# EAGLE design PGTNX04_envelope (EAGLE 9.6.0)
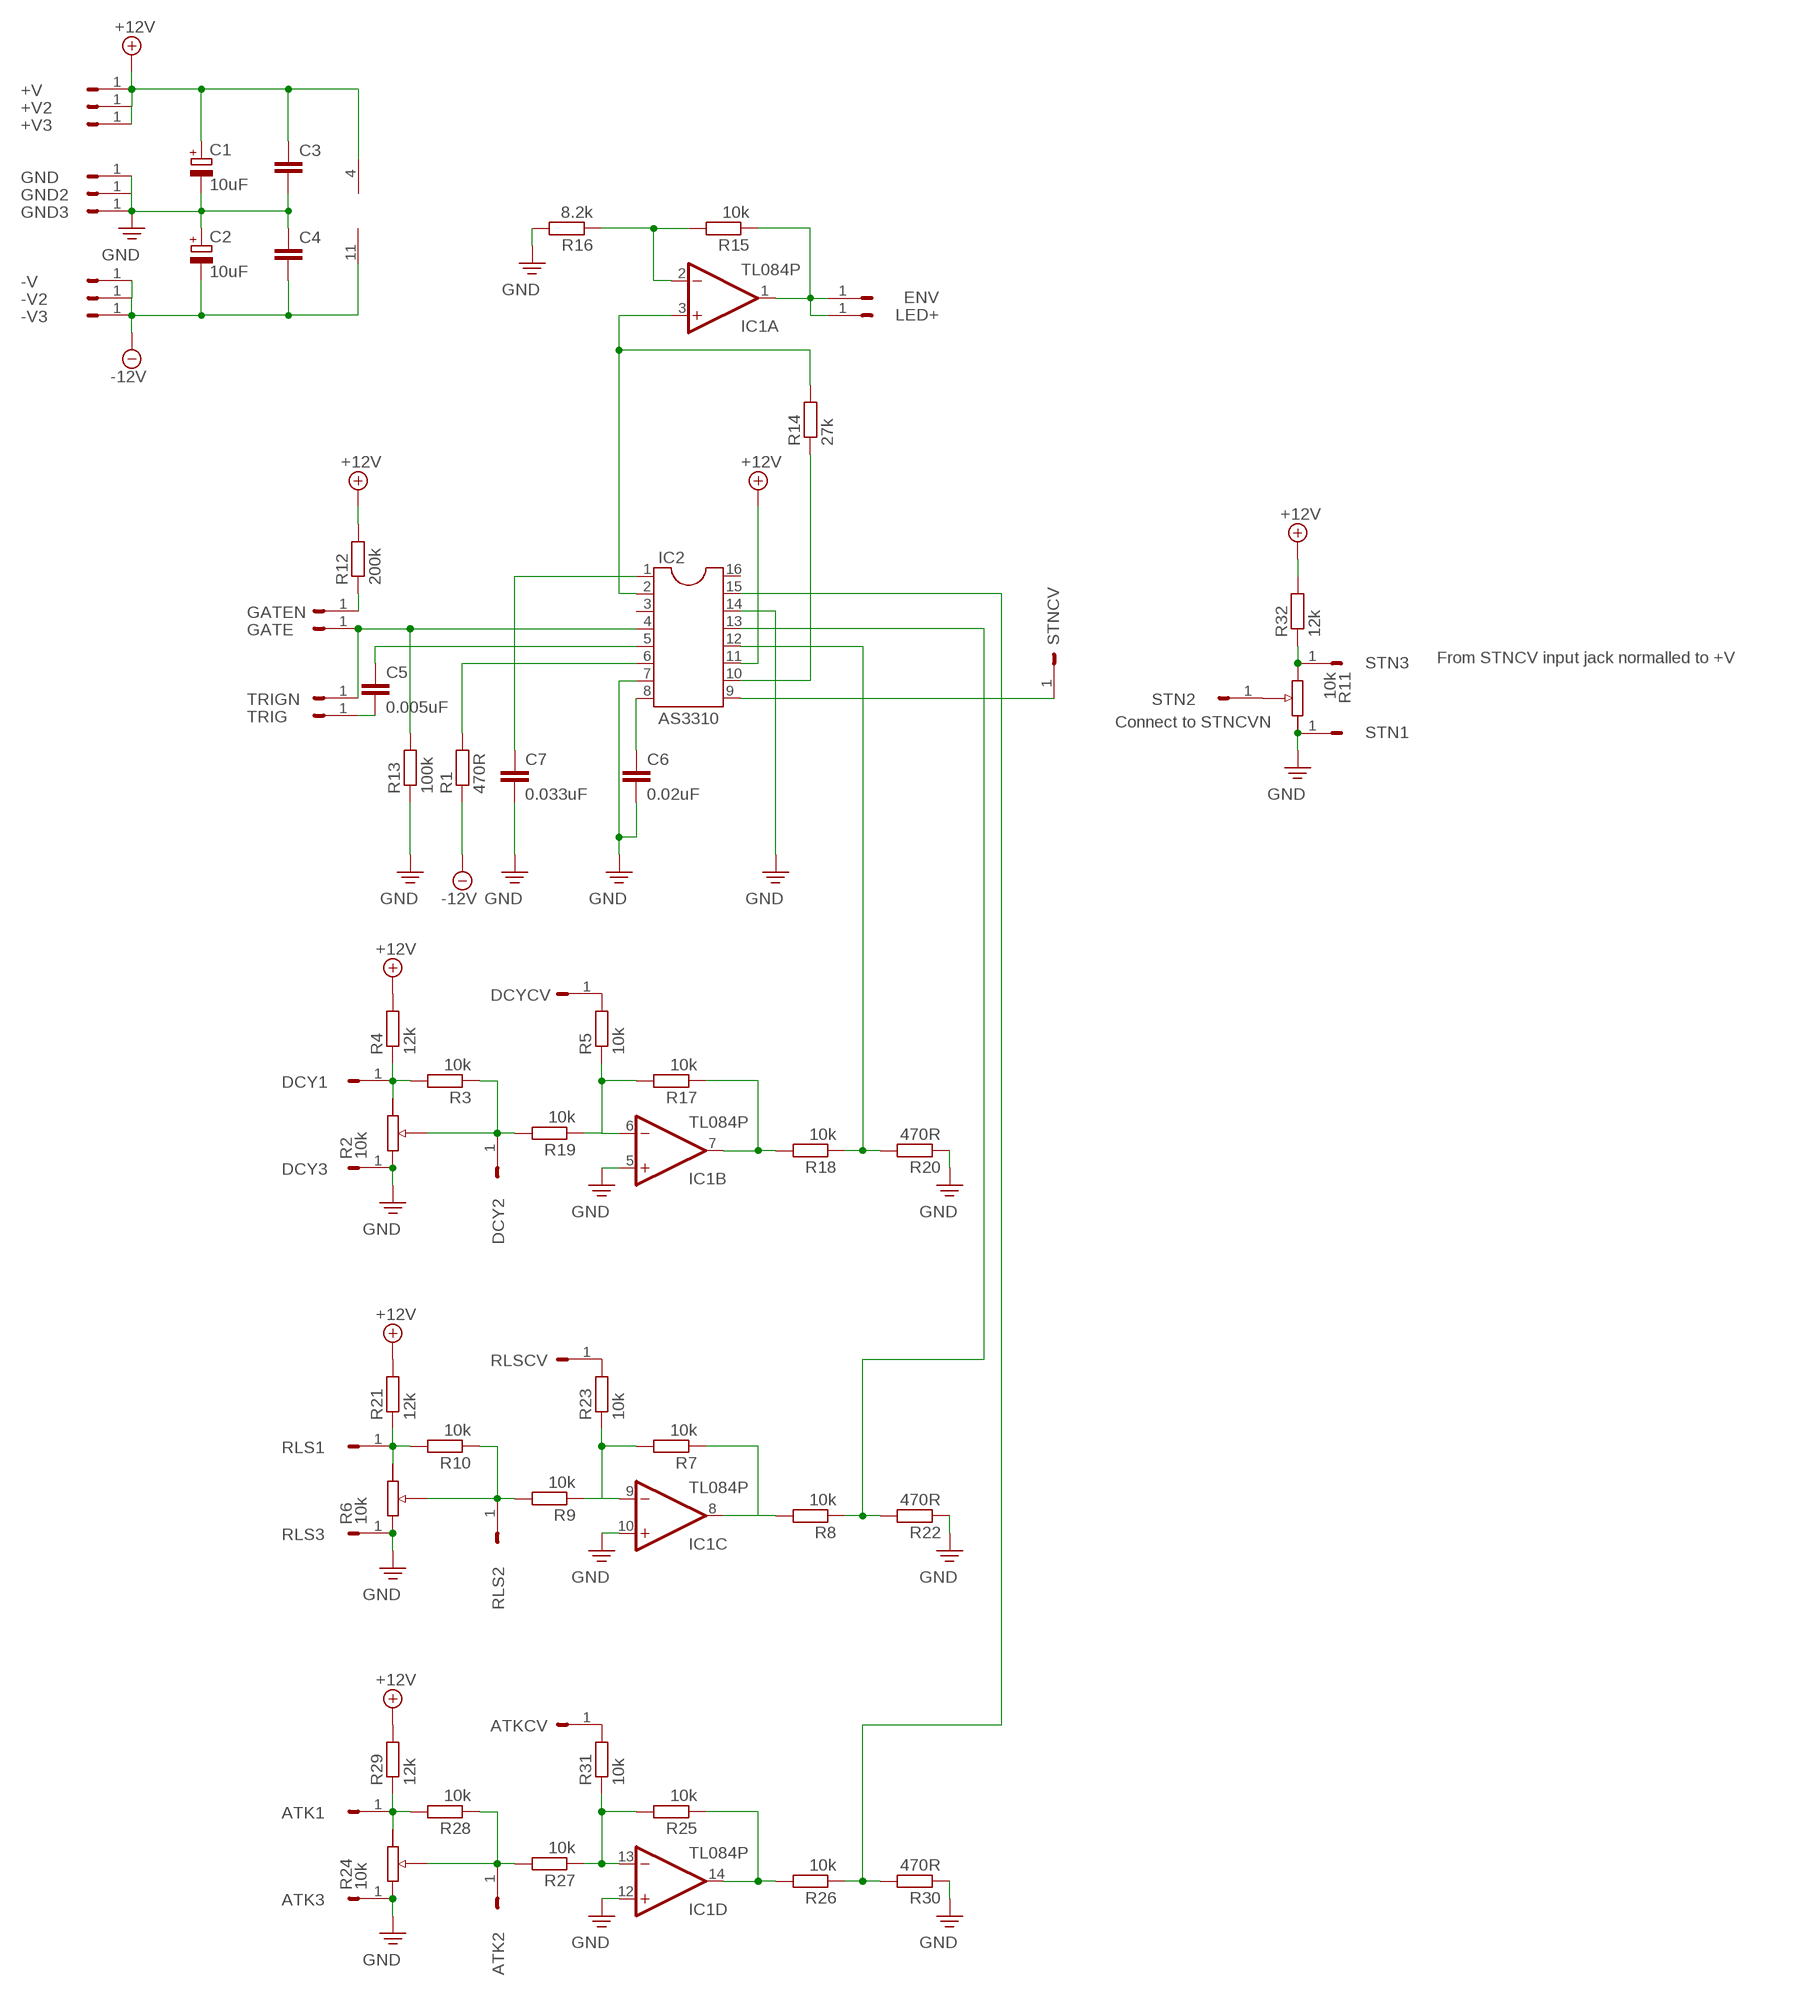
[diagram p0: schematic, sheet 1]

## Parts
+V  HEADER/MALE/01  [HEADER/MALE/01]
+V2  HEADER/MALE/01  [HEADER/MALE/01]
+V3  HEADER/MALE/01  [HEADER/MALE/01]
-V  HEADER/MALE/01  [HEADER/MALE/01]
-V2  HEADER/MALE/01  [HEADER/MALE/01]
-V3  HEADER/MALE/01  [HEADER/MALE/01]
ATK1  HEADER/MALE/01  [HEADER/MALE/01]
ATK2  HEADER/MALE/01  [HEADER/MALE/01]
ATK3  HEADER/MALE/01  [HEADER/MALE/01]
ATKCV  HEADER/MALE/01  [HEADER/MALE/01]
C1  10uF  CAPACITOR/POLARIZEDE2.5-6  [E2,5-6]
C2  10uF  CAPACITOR/POLARIZEDE2.5-6  [E2,5-6]
C3  CAPACITORCERAMICDISC/5  [CERAMICDISC/5]
C4  CAPACITORCERAMICDISC/5  [CERAMICDISC/5]
C5  0.005uF  CAPACITORCERAMICDISC/5  [CERAMICDISC/5]
C6  0.02uF  CAPACITORCERAMICDISC/5  [CERAMICDISC/5]
C7  0.033uF  CAPACITORCERAMICDISC/5  [CERAMICDISC/5]
DCY1  HEADER/MALE/01  [HEADER/MALE/01]
DCY2  HEADER/MALE/01  [HEADER/MALE/01]
DCY3  HEADER/MALE/01  [HEADER/MALE/01]
DCYCV  HEADER/MALE/01  [HEADER/MALE/01]
ENV  HEADER/MALE/01  [HEADER/MALE/01]
GATE  HEADER/MALE/01  [HEADER/MALE/01]
GATEN  HEADER/MALE/01  [HEADER/MALE/01]
GND  HEADER/MALE/01  [HEADER/MALE/01]
GND2  HEADER/MALE/01  [HEADER/MALE/01]
GND3  HEADER/MALE/01  [HEADER/MALE/01]
IC1  TL084P  [DIL14]
IC2  AS3310  DIL16  [DIL16]
LED+  HEADER/MALE/01  [HEADER/MALE/01]
R1  470R  RESISTORRESISTOR/UPRIGHT/7.5  [RESISTOR/7.5]
R2  10k  POTENTIOMETER  (no package)
R3  10k  RESISTORRESISTOR/UPRIGHT/7.5  [RESISTOR/7.5]
R4  12k  RESISTORRESISTOR/UPRIGHT/7.5  [RESISTOR/7.5]
R5  10k  RESISTORRESISTOR/UPRIGHT/7.5  [RESISTOR/7.5]
R6  10k  POTENTIOMETER  (no package)
R7  10k  RESISTORRESISTOR/UPRIGHT/7.5  [RESISTOR/7.5]
R8  10k  RESISTORRESISTOR/UPRIGHT/7.5  [RESISTOR/7.5]
R9  10k  RESISTORRESISTOR/UPRIGHT/7.5  [RESISTOR/7.5]
R10  10k  RESISTORRESISTOR/UPRIGHT/7.5  [RESISTOR/7.5]
R11  10k  POTENTIOMETER  (no package)
R12  200k  RESISTORRESISTOR/UPRIGHT/7.5  [RESISTOR/7.5]
R13  100k  RESISTORRESISTOR/UPRIGHT/7.5  [RESISTOR/7.5]
R14  27k  RESISTORRESISTOR/UPRIGHT/7.5  [RESISTOR/7.5]
R15  10k  RESISTORRESISTOR/UPRIGHT/7.5  [RESISTOR/7.5]
R16  8.2k  RESISTORRESISTOR/UPRIGHT/7.5  [RESISTOR/7.5]
R17  10k  RESISTORRESISTOR/UPRIGHT/7.5  [RESISTOR/7.5]
R18  10k  RESISTORRESISTOR/UPRIGHT/7.5  [RESISTOR/7.5]
R19  10k  RESISTORRESISTOR/UPRIGHT/7.5  [RESISTOR/7.5]
R20  470R  RESISTORRESISTOR/UPRIGHT/7.5  [RESISTOR/7.5]
R21  12k  RESISTORRESISTOR/UPRIGHT/7.5  [RESISTOR/7.5]
R22  470R  RESISTORRESISTOR/UPRIGHT/7.5  [RESISTOR/7.5]
R23  10k  RESISTORRESISTOR/UPRIGHT/7.5  [RESISTOR/7.5]
R24  10k  POTENTIOMETER  (no package)
R25  10k  RESISTORRESISTOR/UPRIGHT/7.5  [RESISTOR/7.5]
R26  10k  RESISTORRESISTOR/UPRIGHT/7.5  [RESISTOR/7.5]
R27  10k  RESISTORRESISTOR/UPRIGHT/7.5  [RESISTOR/7.5]
R28  10k  RESISTORRESISTOR/UPRIGHT/7.5  [RESISTOR/7.5]
R29  12k  RESISTORRESISTOR/UPRIGHT/7.5  [RESISTOR/7.5]
R30  470R  RESISTORRESISTOR/UPRIGHT/7.5  [RESISTOR/7.5]
R31  10k  RESISTORRESISTOR/UPRIGHT/7.5  [RESISTOR/7.5]
R32  12k  RESISTORRESISTOR/UPRIGHT/7.5  [RESISTOR/7.5]
RLS1  HEADER/MALE/01  [HEADER/MALE/01]
RLS2  HEADER/MALE/01  [HEADER/MALE/01]
RLS3  HEADER/MALE/01  [HEADER/MALE/01]
RLSCV  HEADER/MALE/01  [HEADER/MALE/01]
STN1  HEADER/MALE/01  [HEADER/MALE/01]
STN2  HEADER/MALE/01  [HEADER/MALE/01]
STN3  HEADER/MALE/01  [HEADER/MALE/01]
STNCV  HEADER/MALE/01  [HEADER/MALE/01]
TRIG  HEADER/MALE/01  [HEADER/MALE/01]
TRIGN  HEADER/MALE/01  [HEADER/MALE/01]

## Nets
+12V: +V2.1 +V3.1 +V.1 C1.+ C3.1 IC1.4(P:V+) IC2.11 R4.2 R12.2 R21.2 R29.2 R32.2
-12V: -V2.1 -V3.1 -V.1 C2.- C4.2 IC1.11(P:V-) R1.1
GND: ATK3.1 C1.- C2.+ C3.2 C4.1 C6.2 C7.2 DCY3.1 GND2.1 GND3.1 GND.1 IC1.5(B:+IN) IC1.10(C:+IN) IC1.12(D:+IN) IC2.7 IC2.14 R2.E R6.E R11.A R13.1 R16.2 R20.1 R22.1 R24.E R30.1 RLS3.1 STN1.1
N$1: IC2.9 STNCV.1
N$2: GATEN.1 R12.1
N$3: C5.1 IC2.5
N$4: GATE.1 IC2.4 R13.2 TRIGN.1
N$5: DCYCV.1 R5.2
N$6: IC1.8(C:OUT) R7.1 R8.2
N$7: IC1.9(C:-IN) R7.2 R9.1 R23.1
N$8: R6.S R9.2 R10.1 RLS2.1
N$9: C5.2 TRIG.1
N$10: R6.A R10.2 R21.1 RLS1.1
N$11: IC2.13 R8.1 R22.2
N$12: IC2.6 R1.2
N$13: C6.1 IC2.8
N$14: C7.1 IC2.1
N$15: IC1.2(A:-IN) R15.2 R16.1
N$16: IC2.10 R14.1
N$17: IC1.3(A:+IN) IC2.2 R14.2
N$18: ENV.1 IC1.1(A:OUT) LED+.1 R15.1
N$19: IC1.7(B:OUT) R17.1 R18.2
N$20: IC1.6(B:-IN) R5.1 R17.2 R19.1
N$21: DCY2.1 R2.S R3.1 R19.2
N$22: IC2.12 R18.1 R20.2
N$23: DCY1.1 R2.A R3.2 R4.1
N$24: R23.2 RLSCV.1
N$25: IC1.14(D:OUT) R25.1 R26.2
N$26: IC1.13(D:-IN) R25.2 R27.1 R31.1
N$27: ATK2.1 R24.S R27.2 R28.1
N$28: ATK1.1 R24.A R28.2 R29.1
N$29: IC2.15 R26.1 R30.2
N$30: ATKCV.1 R31.2
N$31: R11.E R32.1 STN3.1
N$32: R11.S STN2.1
Unconnected: IC2.3 IC2.16

## Notes on the sheet
- From STNCV input jack normalled to +V
- Connect to STNCVN

## Library data of the parts
+V +V2 +V3 -V -V2 -V3 ATK1-ATK3 ATKCV DCY1-DCY3 DCYCV ENV GATE GATEN GND GND2 GND3 LED+ RLS1-RLS3 RLSCV STN1-STN3 STNCV TRIG TRIGN = connectors:HEADER/MALE/01; SPICEPREFIX: X
C1 C2 = capacitors:CAPACITOR/POLARIZED: POLARIZED CAPACITOR, European symbol; SPICEPREFIX: C
C3-C7 = capacitors:CAPACITOR: CAPACITOR, European symbol
IC1 = ic_analogue:TL084: OP AMP
IC2 = ic_package:DIL16: Dual In Line / Socket
R1 R3-R5 R7-R10 R12-R23 R25-R32 = resistors:RESISTOR: RESISTOR, European symbol
R2 R6 R11 R24 = controls_off_brd:POTENTIOMETER: Trimm resistor; _EXTERNAL_: 1

## Board
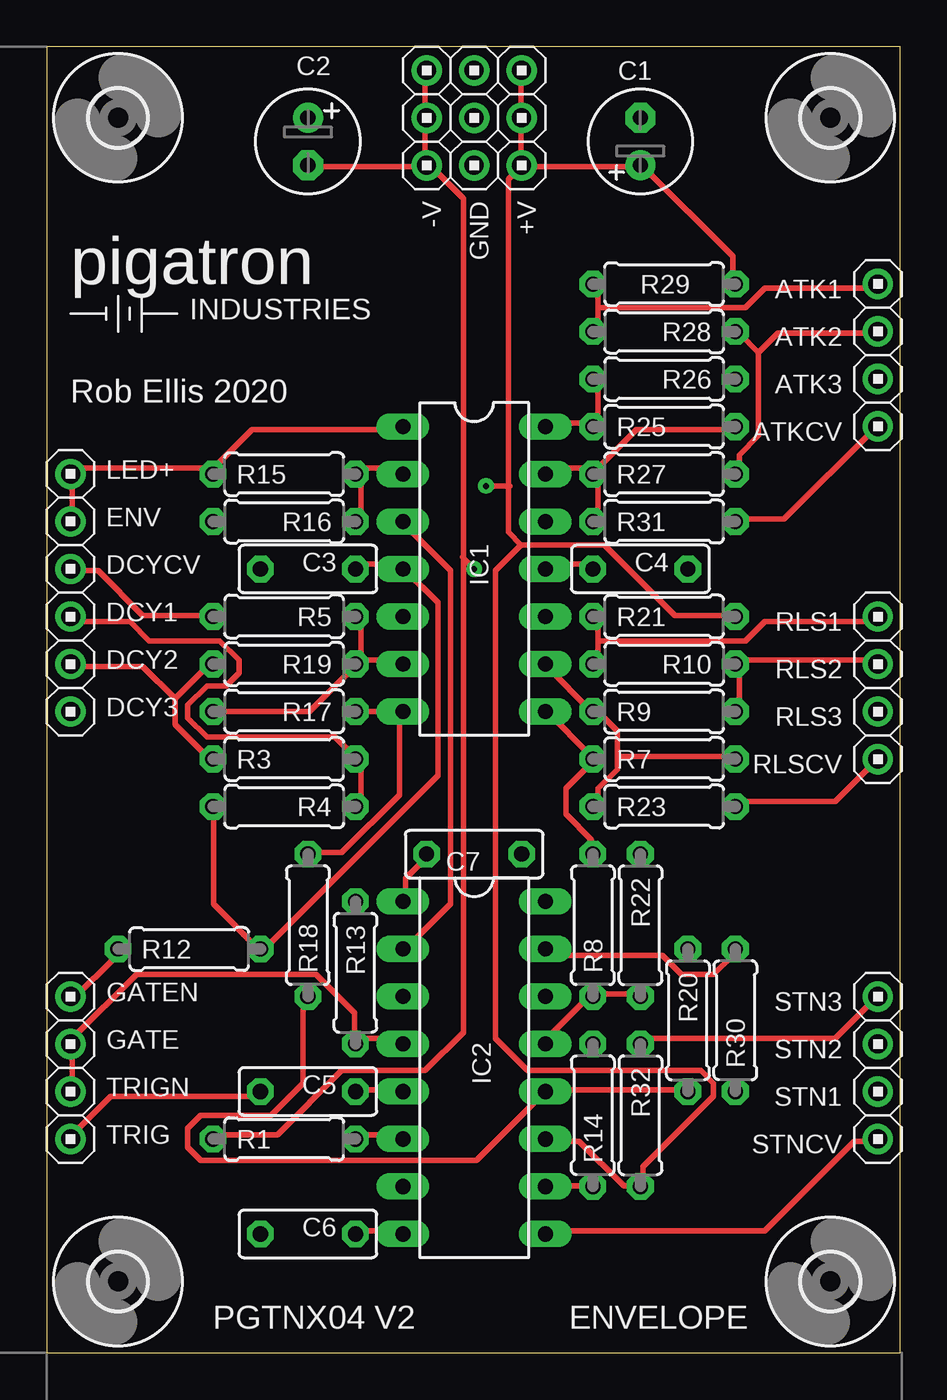
[diagram p1: board, top side]
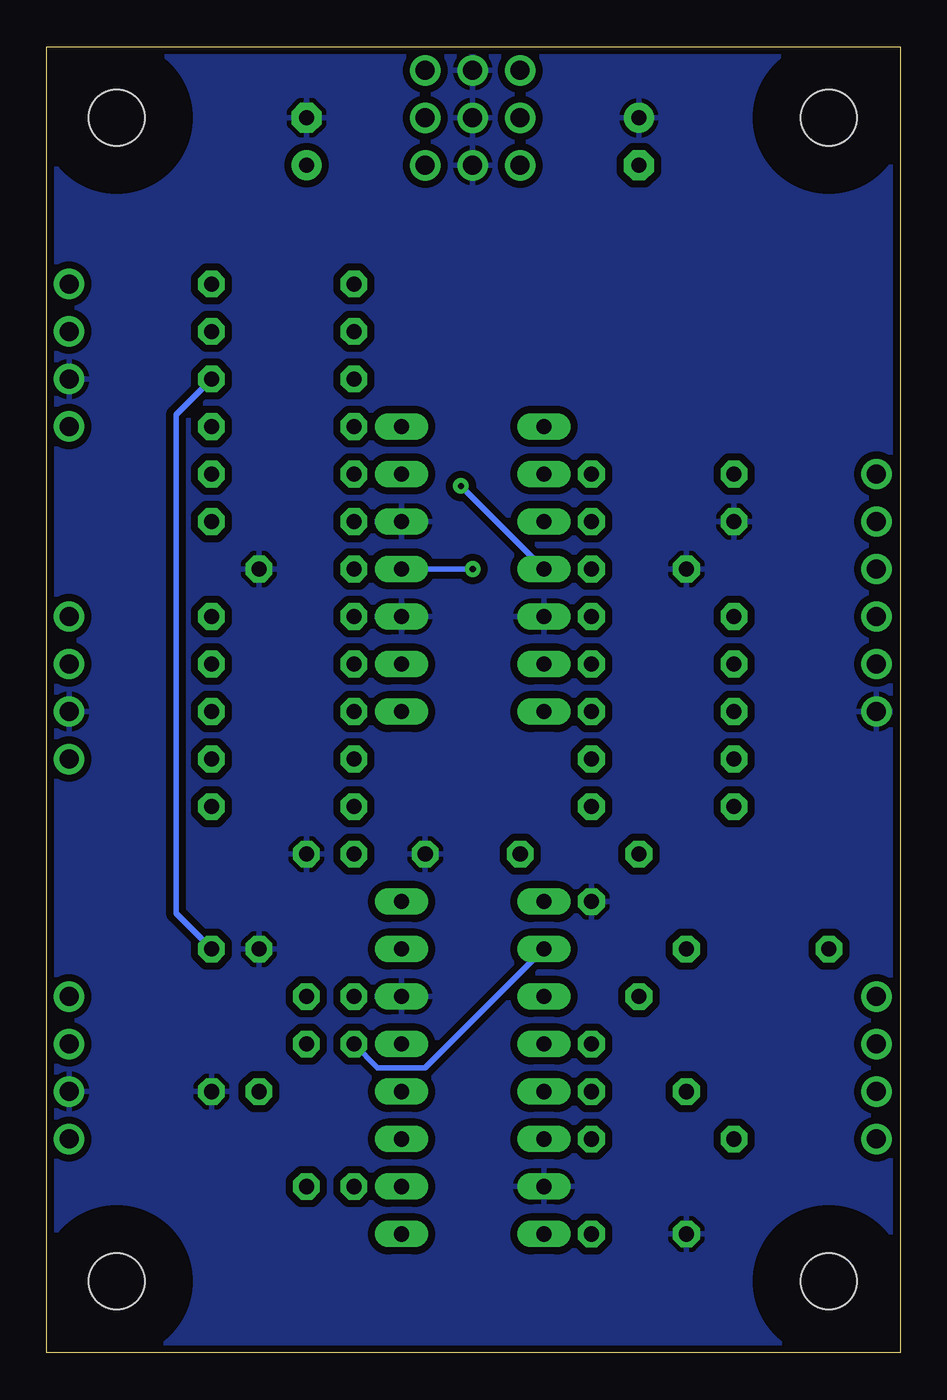
[diagram p2: board, bottom side, seen from below]

Size 45.64 x 69.84 mm. Coordinates in mm from the lower left corner, seen from the top.
Outline: 0,0 45.64,0 45.64,69.84 0,69.84 0,0
Copper layers (1*16): Top 0.0356mm / dielectric 1.5011mm / Bottom 0.0356mm
Design rules "pigatron": minimum track width 12mil, minimum drill 13mil, track to track 15mil, track to pad 10mil, pad to pad 10mil, via to via 10mil, smd to smd 6mil, copper to edge 15mil, drill to drill 10mil, minimum pad ring 12mil, minimum via ring 10mil, stop-mask expansion 4mil, vias tented up to drill 0mil, thermal gap 10mil

### Footprints (pad centres in the part's own frame; a part is rotated, then mirrored left to right if it is on the bottom)
HEADER/MALE/01 = drill 1.016: 1 0,0
E2,5-6 = drill 0.813 pad 1.6: + -1.27,0 | drill 0.813 pad 1.6 octagon: - 1.27,0
CERAMICDISC/5 = drill 0.813 octagon: 1 -2.54,0; 2 2.54,0
DIL14 = drill 0.813 long: 1 -7.62,-3.81; 2 -5.08,-3.81; 3 -2.54,-3.81; 4 0,-3.81; 5 2.54,-3.81; 6 5.08,-3.81; 7 7.62,-3.81; 8 7.62,3.81; 9 5.08,3.81; 10 2.54,3.81; 11 0,3.81; 12 -2.54,3.81; 13 -5.08,3.81; 14 -7.62,3.81
DIL16 = drill 0.813 long: 1 -8.89,-3.81; 2 -6.35,-3.81; 3 -3.81,-3.81; 4 -1.27,-3.81; 5 1.27,-3.81; 6 3.81,-3.81; 7 6.35,-3.81; 8 8.89,-3.81; 9 8.89,3.81; 10 6.35,3.81; 11 3.81,3.81; 12 1.27,3.81; 13 -1.27,3.81; 14 -3.81,3.81; 15 -6.35,3.81; 16 -8.89,3.81
RESISTOR/7.5 = drill 0.813 octagon: 1 -3.81,0; 2 3.81,0
STANDOFF/3.0 = hole 3: 0,0

### Placement (x,y rotation side)
+V  25.4,63.5 270 top
+V2  25.4,66.04 270 top
+V3  25.4,68.58 270 top
-V  20.32,63.5 270 top
-V2  20.32,66.04 270 top
-V3  20.32,68.58 270 top
ATK1  44.45,57.15 180 top
ATK2  44.45,54.61 180 top
ATK3  44.45,52.07 180 top
ATKCV  44.45,49.53 180 top
C1  31.75,64.77 90 top
C2  13.97,64.77 270 top
C3  13.97,41.91 180 top
C4  31.75,41.91 180 top
C5  13.97,13.97 180 top
C6  13.97,6.35 180 top
C7  22.86,26.67 0 top
DCY1  1.27,39.37 0 top
DCY2  1.27,36.83 0 top
DCY3  1.27,34.29 0 top
DCYCV  1.27,41.91 0 top
ENV  1.27,44.45 0 top
GATE  1.27,16.51 0 top
GATEN  1.27,19.05 0 top
GND  22.86,63.5 270 top
GND2  22.86,68.58 270 top
GND3  22.86,66.04 270 top
IC1  22.86,41.91 270 top
IC2  22.86,15.24 270 top
LED+  1.27,46.99 0 top
R1  12.7,11.43 0 top
R3  12.7,31.75 0 top
R4  12.7,29.21 180 top
R5  12.7,39.37 180 top
R7  33.02,31.75 0 top
R8  29.21,22.86 90 top
R9  33.02,34.29 0 top
R10  33.02,36.83 180 top
R12  7.62,21.59 0 top
R13  16.51,20.32 270 top
R14  29.21,12.7 90 top
R15  12.7,46.99 0 top
R16  12.7,44.45 180 top
R17  12.7,34.29 180 top
R18  13.97,22.86 90 top
R19  12.7,36.83 180 top
R20  34.29,17.78 270 top
R21  33.02,39.37 0 top
R22  31.75,22.86 270 top
R23  33.02,29.21 0 top
R25  33.02,49.53 0 top
R26  33.02,52.07 180 top
R27  33.02,46.99 0 top
R28  33.02,54.61 180 top
R29  33.02,57.15 0 top
R30  36.83,17.78 90 top
R31  33.02,44.45 0 top
R32  31.75,12.7 270 top
RLS1  44.45,39.37 180 top
RLS2  44.45,36.83 180 top
RLS3  44.45,34.29 180 top
RLSCV  44.45,31.75 180 top
STN1  44.45,13.97 180 top
STN2  44.45,16.51 180 top
STN3  44.45,19.05 180 top
STNCV  44.45,11.43 180 top
TRIG  1.27,11.43 0 top
TRIGN  1.27,13.97 0 top
U$1  [STANDOFF/3.0]  3.81,3.81 0 top
U$2  [STANDOFF/3.0]  41.91,3.81 0 top
U$3  [STANDOFF/3.0]  3.81,66.04 0 top
U$4  [STANDOFF/3.0]  41.91,66.04 0 top
U$5  [PIGATRON-LOGO]  10.16,57.15 0 top

### Tracks (layer width: path | path; a pad name or v marks a point on that pad's centre or on a via)
+12V  (via drill 0.33)
  Top 0.305: C3.1 16.8,42.18 18.86,42.18 IC1.4 19.2,41.83 20.92,40.12 20.92,30.86 11.66,21.6 R12.2 11.32,21.6 8.91,24 8.91,29.15 R4.2 | R29.2 36.69,57.26 36.69,58.64 31.89,63.44 C1.+ 31.55,63.44 25.72,63.44 +V.1 | IC2.11 26.75,11.32 28.46,11.32 30.86,8.91 31.55,8.91 R32.2 31.89,8.91 31.89,9.94 35.66,13.72 35.66,14.4 34.98,15.09 25.72,15.09 24,16.8 24,41.83 25.38,43.2 | 25.38,43.2 29.83,43.2 33.6,39.43 36.69,39.43 R21.2 | 25.38,43.2 24.69,43.89 24.69,46.35 | 24.69,46.35 24.69,62.75 25.38,63.44 +V.1 | +V.1 25.38,63.78 25.38,65.84 +V2.1 25.38,66.18 25.38,68.58 +V3.1 | 24.69,46.35 v23.5,46.35 | 24.77,46.35 24.69,46.35
  Bottom 0.305: v23.5,46.35 IC1.4
-12V  (via drill 0.33)
  Top 0.305: 22.29,42.55 22.29,61.72 20.57,63.44 -V.1 | 22.29,42.55 22.29,17.14 20.23,15.09 15.77,15.09 12.34,11.66 8.91,11.66 R1.1 | C2.- 14.06,63.44 20.23,63.44 -V.1 | -V.1 20.23,63.78 20.23,65.84 -V2.1 20.23,66.18 20.23,68.58 -V3.1 | IC1.11 26.75,42.18 29.15,42.18 C4.2 | v22.86,41.91 22.23,42.55 22.29,42.55
  Bottom 0.305: v22.86,41.91 IC1.11
GND
  pour Bottom: 0,69.85 0,0 45.72,0 45.72,69.85
N$1
  Top 0.305: IC2.9 26.75,6.51 38.41,6.51 43.2,11.32 44.23,11.32 STNCV.1
N$2
  Top 0.305: R12.1 3.77,21.26 1.37,18.86 GATEN.1
N$3
  Top 0.305: C5.1 16.8,14.06 18.86,14.06 IC2.5
N$4
  Top 0.305: IC2.4 18.86,16.8 16.8,16.8 R13.2 16.46,16.8 16.46,18.17 14.4,20.23 4.8,20.23 1.37,16.8 GATE.1 1.37,16.46 1.37,14.06 TRIGN.1
N$5
  Top 0.305: R5.2 8.57,39.43 5.14,39.43 2.74,41.83 1.37,41.83 DCYCV.1
N$6
  Top 0.305: IC1.8 26.75,34.29 29.15,31.89 R7.1 29.15,31.55 27.77,30.18 27.77,28.8 29.15,27.43 29.15,26.75 R8.2
N$7
  Top 0.305: IC1.9 26.75,36.69 29.15,34.29 R9.1 29.49,34.29 30.52,33.26 30.52,31.89 | 30.52,31.89 30.52,31.2 29.49,30.18 29.49,29.49 R23.1 | 30.52,31.89 36.69,31.89 R7.2
N$8
  Top 0.305: R9.2 37.03,34.29 37.03,36.69 R10.1 37.03,37.03 44.23,37.03 RLS2.1
N$9
  Top 0.305: C5.2 11.32,13.72 3.43,13.72 1.37,11.66 TRIG.1
N$10
  Top 0.305: 29.49,38.06 29.49,39.09 R21.1 | 29.49,38.06 29.49,37.03 R10.2 | 29.49,38.06 37.38,38.06 38.41,39.09 44.23,39.09 RLS1.1
N$11
  Top 0.305: IC2.13 26.75,16.8 29.15,19.2 R8.1 29.49,19.2 31.55,19.2 R22.2
N$12
  Top 0.305: R1.2 16.8,11.66 18.86,11.66 IC2.6
N$13
  Top 0.305: C6.1 16.8,6.51 18.86,6.51 IC2.8
N$14
  Top 0.305: IC2.1 19.2,24.35 19.2,25.38 20.23,26.4 C7.1
N$15
  Top 0.305: R16.1 16.8,44.58 16.8,46.98 R15.2 16.8,47.32 18.86,47.32 IC1.2
N$16
  Top 0.305: IC2.10 26.75,8.91 29.15,8.91 R14.1
N$17
  Top 0.305: IC2.2 19.2,21.6 21.6,24 21.6,41.83 19.2,44.23 IC1.3
  Bottom 0.305: R14.2 27.94,15.24 25.4,15.24 IC2.2
N$18
  Top 0.305: IC1.1 18.86,49.38 10.97,49.38 8.91,47.32 R15.1 8.57,47.32 1.37,47.32 LED+.1 1.37,46.98 1.37,44.58 ENV.1
N$19
  Top 0.305: 18.86,34.29 18.86,29.83 15.77,26.75 14.06,26.75 R18.2 | 18.86,34.29 R17.1 | 18.86,34.29 IC1.7
N$20
  Top 0.305: R17.2 14.06,34.29 16.46,36.69 R19.1 16.8,37.03 | 16.8,37.03 18.86,37.03 IC1.6 | 16.8,37.03 16.8,39.09 R5.1
N$21
  Top 0.305: 6.86,34.98 6.86,33.6 8.57,31.89 R3.1 | 6.86,34.98 8.57,36.69 R19.2 | 6.86,34.98 5.14,36.69 1.37,36.69 DCY2.1
N$22
  Top 0.305: R20.2 34.29,14.06 26.75,14.06 IC2.12 26.4,13.72 22.97,10.29 8.23,10.29 7.54,10.97 7.54,12 8.23,12.69 12,12.69 13.72,14.4 13.72,18.86 R18.1
N$23
  Top 0.305: R4.1 16.8,29.49 16.8,31.55 R3.2 16.46,31.89 15.43,32.92 8.57,32.92 7.54,33.95 7.54,34.63 8.57,35.66 9.6,35.66 10.29,36.35 10.29,37.03 9.26,38.06 5.49,38.06 4.46,39.09 1.37,39.09 DCY1.1
N$24
  Top 0.305: R23.2 37.03,29.49 42.18,29.49 44.23,31.55 RLSCV.1
N$25
  Top 0.305: IC1.14 26.75,49.72 29.15,49.72 R25.1 29.49,49.72 29.49,51.78 R26.2
N$26
  Top 0.305: R31.1 29.49,44.58 29.49,46.98 R27.1 | IC1.13 26.75,47.32 29.15,47.32 R27.1 | R25.2 36.69,49.38 31.55,49.38 29.49,47.32 R27.1
N$27
  Top 0.305: 38.06,53.49 38.06,49.03 37.03,48.01 37.03,47.32 R27.2 | 38.06,53.49 37.03,54.52 R28.1 | 38.06,53.49 39.09,54.52 44.23,54.52 ATK2.1
N$28
  Top 0.305: 29.49,55.89 29.49,56.92 R29.1 | 29.49,55.89 29.49,54.86 R28.2 | 29.49,55.89 37.38,55.89 38.41,56.92 44.23,56.92 ATK1.1
N$29
  Top 0.305: IC2.15 26.75,21.26 32.92,21.26 33.95,20.23 35.66,20.23 36.69,21.26 R30.2
  Bottom 0.305: R26.1 38.73,50.16 38.73,23.5 R30.2
N$30
  Top 0.305: R31.2 37.03,44.58 39.43,44.58 44.23,49.38 ATKCV.1
N$31
  Top 0.305: R32.1 31.89,16.8 42.18,16.8 44.23,18.86 STN3.1

### Text on the board
tNames: Rob Ellis 2020 | PGTNX04 V2 | ENVELOPE